# Altium project LED STRING.PrjPcb
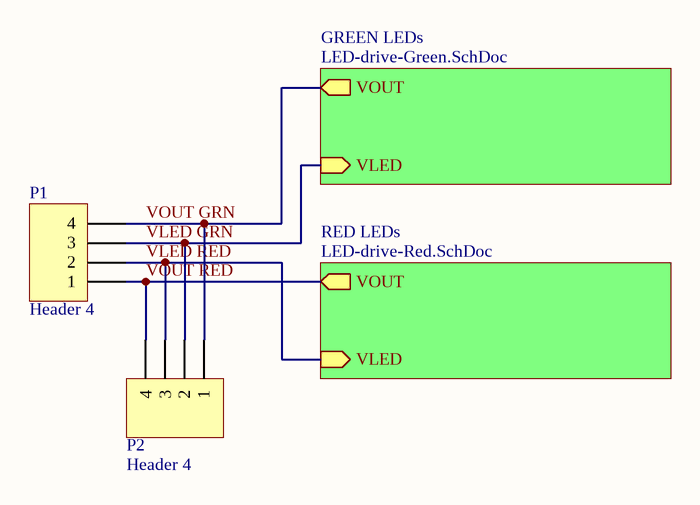
[diagram p0: QUTMS-TSAL-LEDs.SchDoc]
3 sheets, 9 parts. Net scope: hierarchical (ports join the sheet entries above them; power ports are global).
Board file: TSAL-LED_STRING.PcbDoc
Sheets:
  QUTMS-TSAL-LEDs.SchDoc
    GREEN LEDs = LED-drive-Green.SchDoc
    RED LEDs = LED-drive-Red.SchDoc

## Sheet QUTMS-TSAL-LEDs.SchDoc
size A4; SheetNumber: 1; SheetTotal: 3

### Parts
P1  Header 4  [HDR1X4]
P2  Header 4  [HDR1X4]

### Sub-sheets
GREEN LEDs = LED-drive-Green.SchDoc: VLED (in), VOUT (out)
RED LEDs = LED-drive-Red.SchDoc: VLED (in), VOUT (out)

### Nets
VLED GRN: P1.3 P2.2 ; sheet GREEN LEDs/VLED
VLED RED: P1.2 P2.3 ; sheet RED LEDs/VLED
VOUT GRN: P1.4 P2.1 ; sheet GREEN LEDs/VOUT
VOUT RED: P1.1 P2.4 ; sheet RED LEDs/VOUT

### Library data of the parts
P1 P2 = Header 4: Header, 4-Pin; LatestRevisionDate: 17-Jul-2002; LatestRevisionNote: Re-released for DXP Platform.; Publisher: Altium Limited

## Sheet LED-drive-Green.SchDoc
size A4; SheetNumber: 3; SheetTotal: 3
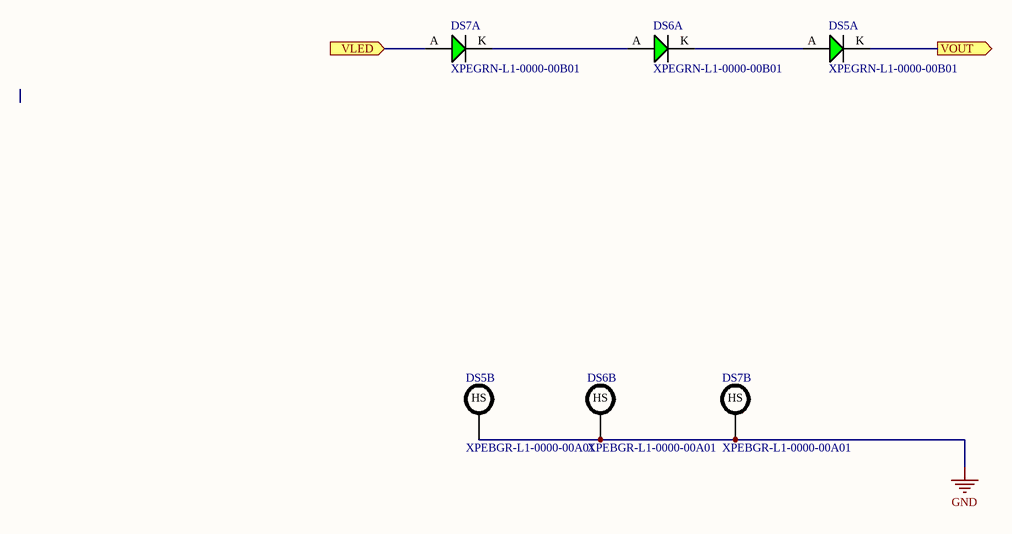
[diagram p1: LED-drive-Green.SchDoc]

### Parts
DS5  XPEGRN-L1-0000-00B01  [Cree XLamp XP-E2 (red and green LED)]  (parts A,B of 2)
DS6  XPEGRN-L1-0000-00B01  [Cree XLamp XP-E2 (red and green LED)]  (parts A,B of 2)
DS7  XPEGRN-L1-0000-00B01  [Cree XLamp XP-E2 (red and green LED)]  (parts A,B of 2)

### Ports
VLED (in), VOUT (out)

### Nets
GND: DS5.HS DS6.HS DS7.HS
VLED GRN: DS7.A ; port VLED
VOUT GRN: DS5.K ; port VOUT
NetDS5_A: DS5.A DS6.K
NetDS6_A: DS6.A DS7.K

### Library data of the parts
DS5-DS7 = XPEBGR-L1-0000-00A01: LED, Cree XLamp XP-E2 Series, Green, 535 nm, 135 °, 87.4 lm, 1 A; ComponentLink1Description: Element14; ComponentLink1URL: https://au.element14.com/cree/xpebrd-l1-0000-00601/led-smd-xlamp-xpe-e-red-62lm/dp/2335107

## Sheet LED-drive-Red.SchDoc
size A4; SheetNumber: 2; SheetTotal: 3
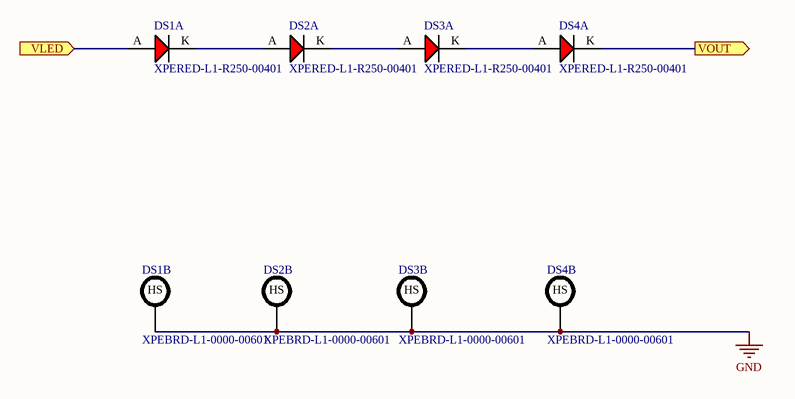
[diagram p2: LED-drive-Red.SchDoc]

### Parts
DS1  XPERED-L1-R250-00401  [Cree XLamp XP-E2 (red and green LED)]  (parts A,B of 2)
DS2  XPERED-L1-R250-00401  [Cree XLamp XP-E2 (red and green LED)]  (parts A,B of 2)
DS3  XPERED-L1-R250-00401  [Cree XLamp XP-E2 (red and green LED)]  (parts A,B of 2)
DS4  XPERED-L1-R250-00401  [Cree XLamp XP-E2 (red and green LED)]  (parts A,B of 2)

### Ports
VLED (in), VOUT (out)

### Nets
GND: DS1.HS DS2.HS DS3.HS DS4.HS
VLED RED: DS1.A ; port VLED
VOUT RED: DS4.K ; port VOUT
NetDS1_K: DS1.K DS2.A
NetDS2_K: DS2.K DS3.A
NetDS3_K: DS3.K DS4.A

### Library data of the parts
DS1-DS4 = XPEBRD-L1-0000-00601: LED, Cree XLamp XP-E2 Series, Red, 630 nm, 130 °, 62 lm, 1 A; ComponentLink1Description: Element14; ComponentLink1URL: https://au.element14.com/cree/xpebrd-l1-0000-00601/led-smd-xlamp-xpe-e-red-62lm/dp/2335107

## Nets that join several sheets
GND: LED-drive-Green (DS5.HS DS6.HS DS7.HS), LED-drive-Red (DS1.HS DS2.HS DS3.HS DS4.HS)
VLED GRN: QUTMS-TSAL-LEDs (P1.3 P2.2), LED-drive-Green (DS7.A)
VLED RED: QUTMS-TSAL-LEDs (P1.2 P2.3), LED-drive-Red (DS1.A)
VOUT GRN: QUTMS-TSAL-LEDs (P1.4 P2.1), LED-drive-Green (DS5.K)
VOUT RED: QUTMS-TSAL-LEDs (P1.1 P2.4), LED-drive-Red (DS4.K)